# EAGLE design MAin_Backup (EAGLE 7.2.0)
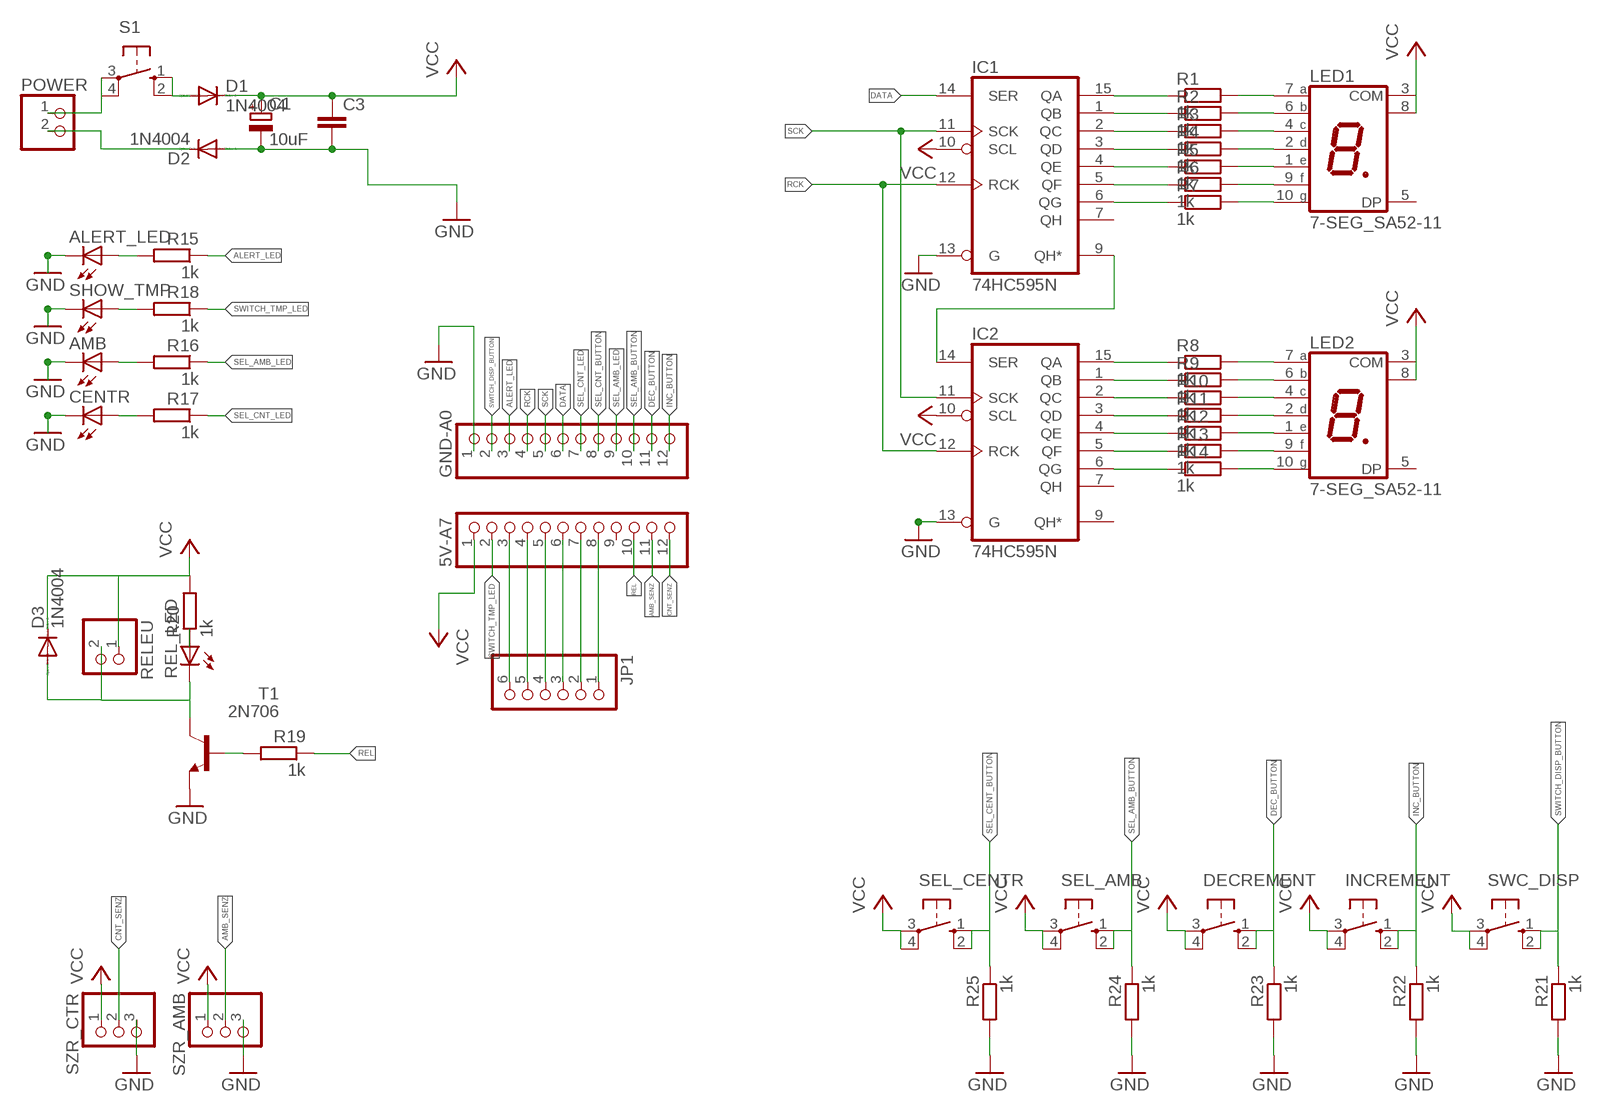
[diagram p0: schematic, sheet 1]

## Parts
5V-A7  PINHD-1X12  [1X12]
ALERT_LED  LED5MM  [LED5MM]
AMB  LED5MM  [LED5MM]
C1  10uF  CPOL-EUE2-5  [E2-5]
C3  C-EU025-024X044  [C025-024X044]
CENTR  LED5MM  [LED5MM]
D1  1N4004  [DO41-10]
D2  1N4004  [DO41-10]
D3  1N4004  [DO41-10]
DECREMENT  40-XX  [B3F-40XX]
GND-A0  PINHD-1X12  [1X12]
IC1  74HC595N  [DIL16]
IC2  74HC595N  [DIL16]
INCREMENT  40-XX  [B3F-40XX]
JP1  PINHD-1X6  [1X06]
LED1  7-SEG_SA52-11  [SA52-11]
LED2  7-SEG_SA52-11  [SA52-11]
POWER  PINHD-1X2  [1X02]
R1  1k  R-EU_0309/12  [0309/12]
R2  1k  R-EU_0309/12  [0309/12]
R3  1k  R-EU_0309/12  [0309/12]
R4  1k  R-EU_0309/12  [0309/12]
R5  1k  R-EU_0309/12  [0309/12]
R6  1k  R-EU_0309/12  [0309/12]
R7  1k  R-EU_0309/12  [0309/12]
R8  1k  R-EU_0309/12  [0309/12]
R9  1k  R-EU_0309/12  [0309/12]
R10  1k  R-EU_0309/12  [0309/12]
R11  1k  R-EU_0309/12  [0309/12]
R12  1k  R-EU_0309/12  [0309/12]
R13  1k  R-EU_0309/12  [0309/12]
R14  1k  R-EU_0309/12  [0309/12]
R15  1k  R-EU_0309/12  [0309/12]
R16  1k  R-EU_0309/12  [0309/12]
R17  1k  R-EU_0309/12  [0309/12]
R18  1k  R-EU_0309/12  [0309/12]
R19  1k  R-EU_0309/12  [0309/12]
R20  1k  R-EU_0309/12  [0309/12]
R21  1k  R-EU_0309/12  [0309/12]
R22  1k  R-EU_0309/12  [0309/12]
R23  1k  R-EU_0309/12  [0309/12]
R24  1k  R-EU_0309/12  [0309/12]
R25  1k  R-EU_0309/12  [0309/12]
REL_LED  LED5MM  [LED5MM]
RELEU  PINHD-1X2  [1X02]
S1  10-XX  [B3F-10XX]
SEL_AMB  40-XX  [B3F-40XX]
SEL_CENTR  40-XX  [B3F-40XX]
SHOW_TMP  LED5MM  [LED5MM]
SWC_DISP  40-XX  [B3F-40XX]
SZR_AMB  PINHD-1X3  [1X03]
SZR_CTR  PINHD-1X3  [1X03]
T1  2N706  [TO18]

## Nets
ALERT_LED: GND-A0.3 R15.1
AMB_SENZ: 5V-A7.11 SZR_AMB.2
CNT_SENZ: 5V-A7.12 SZR_CTR.2
DATA: GND-A0.6 IC1.14(SER)
DEC_BUTTON: DECREMENT.1(S) DECREMENT.2(S1) GND-A0.11 R23.1
GND: ALERT_LED.K(C) AMB.K(C) C1.- C3.2 CENTR.K(C) D2.A GND-A0.1 IC1.13(G) IC2.13(G) R21.2 R22.2 R23.2 R24.2 R25.2 SHOW_TMP.K(C) SZR_AMB.3 SZR_CTR.3 T1.1(E)
INC_BUTTON: GND-A0.12 INCREMENT.1(S) INCREMENT.2(S1) R22.1
N$1: LED1.7(A) R1.2
N$2: LED1.6(B) R2.2
N$3: LED1.4(C) R3.2
N$4: LED1.2(D) R4.2
N$5: LED1.1(E) R5.2
N$6: LED1.9(F) R6.2
N$7: LED1.10(G) R7.2
N$8: LED2.7(A) R8.2
N$9: LED2.6(B) R9.2
N$10: LED2.4(C) R10.2
N$11: LED2.2(D) R11.2
N$12: LED2.1(E) R12.2
N$13: LED2.9(F) R13.2
N$14: LED2.10(G) R14.2
N$15: IC1.15(QA) R1.1
N$16: IC1.1(QB) R2.1
N$17: IC1.2(QC) R3.1
N$18: IC1.3(QD) R4.1
N$19: IC1.4(QE) R5.1
N$20: IC1.5(QF) R6.1
N$21: IC1.6(QG) R7.1
N$22: IC2.15(QA) R8.1
N$23: IC2.1(QB) R9.1
N$24: IC2.2(QC) R10.1
N$25: IC2.3(QD) R11.1
N$26: IC2.4(QE) R12.1
N$27: IC2.5(QF) R13.1
N$28: IC2.6(QG) R14.1
N$29: IC1.9(QH*) IC2.14(SER)
N$30: 5V-A7.8 JP1.1
N$31: 5V-A7.7 JP1.2
N$32: 5V-A7.6 JP1.3
N$33: 5V-A7.5 JP1.4
N$34: 5V-A7.4 JP1.5
N$35: 5V-A7.3 JP1.6
N$36: D1.A S1.1(S) S1.2(S1)
N$37: POWER.1 S1.3(P) S1.4(P1)
N$38: ALERT_LED.A R15.2
N$41: D2.C POWER.2
N$43: R20.1 REL_LED.A
N$44: R19.2 T1.2(B)
N$47: AMB.A R16.2
N$48: CENTR.A R17.2
N$49: R18.2 SHOW_TMP.A
N$54: D3.A REL_LED.K(C) RELEU.2 T1.3(C)
RCK: GND-A0.4 IC1.12(RCK) IC2.12(RCK)
REL: 5V-A7.10 R19.1
SCK: GND-A0.5 IC1.11(SCK) IC2.11(SCK)
SEL_AMB_BUTTON: GND-A0.10 R24.1 SEL_AMB.1(S) SEL_AMB.2(S1)
SEL_AMB_LED: GND-A0.9 R16.1
SEL_CENT_BUTTON: GND-A0.7 R25.1 SEL_CENTR.1(S) SEL_CENTR.2(S1)
SEL_CNT_BUTTON: GND-A0.8
SEL_CNT_LED: R17.1
SWITCH_DISP_BUTTON: GND-A0.2 R21.1 SWC_DISP.1(S) SWC_DISP.2(S1)
SWITCH_TMP_LED: 5V-A7.2 R18.1
VCC: 5V-A7.1 C1.+ C3.1 D1.C D3.C DECREMENT.3(P) DECREMENT.4(P1) IC1.10(SCL) IC2.10(SCL) INCREMENT.3(P) INCREMENT.4(P1) LED1.3(COM) LED1.8(COM) LED2.3(COM) LED2.8(COM) R20.2 RELEU.1 SEL_AMB.3(P) SEL_AMB.4(P1) SEL_CENTR.3(P) SEL_CENTR.4(P1) SWC_DISP.3(P) SWC_DISP.4(P1) SZR_AMB.1 SZR_CTR.1
Unconnected: 5V-A7.9 IC1.7(QH) IC2.7(QH) IC2.9(QH*) LED1.5(DP) LED2.5(DP)

## Power pins joined to a net without a drawn wire
GND: IC1.8(GND) IC2.8(GND)
VCC: IC1.16(VCC) IC2.16(VCC)

## Library data of the parts
5V-A7 GND-A0 = pinhead:PINHD-1X12: PIN HEADER
ALERT_LED AMB CENTR REL_LED SHOW_TMP = led:LED: LED OSRAM: - CHIPLED LG R971, LG N971, LY N971, LG Q971, LY Q971, LO R971, LY R971 LH N974, LH R974 LS Q976, LO Q976, LY Q976 LO Q996 - Hyper CHIPLED LW Q18S LB Q993, LB Q99A, LB R99A - SideLED LS A670, LO A670, LY A670, LG A670, LP A670 LB A673, LV A673, LT A673, LW A673 LH A674 LY A675 LS A676, LA A676, LO A676, LY A676, LW A676 LS A679, LY A679, LG A679 - Hyper Micro SIDELED® LS Y876, LA Y876, LO Y876, LY Y876 LT Y87S - SmartLED LW L88C, LW L88S LB L89C, LB L89S, LG L890 LS L89K, LO L89K, LY L89K LS L896, LA L896, LO L896, LY L896 - TOPLED LS T670, LO T670, LY T670, LG T670, LP T670 LSG T670, LSP T670, LSY T670, LOP T670, LYG T670 LG T671, LOG T671, LSG T671 LB T673, LV T673, LT T673, LW T673 LH T674 LS T676, LA T676, LO T676, LY T676, LB T676, LH T676, LSB T676, LW T676 LB T67C, LV T67C, LT T67C, LS T67K, LO T67K, LY T67K, LW E67C LS E67B, LA E67B, LO E67B, LY E67B, LB E67C, LV E67C, LT E67C LW T67C LS T679, LY T679, LG T679 LS T770, LO T770, LY T770, LG T770, LP T770 LB T773, LV T773, LT T773, LW T773 LH T774 LS E675, LA E675, LY E675, LS T675 LS T776, LA T776, LO T776, LY T776, LB T776 LHGB T686 LT T68C, LB T68C - Hyper Mini TOPLED® LB M676 - Mini TOPLED Santana® LG M470 LS M47K, LO M47K, LY M47K Source: http://www.osram.convergy.de LUXEON: - LUMILED® LXK2-PW12-R00, LXK2-PW12-S00, LXK2-PW14-U00, LXK2-PW14-V00 LXK2-PM12-R00, LXK2-PM12-S00, LXK2-PM14-U00 LXK2-PE12-Q00, LXK2-PE12-R00, LXK2-PE12-S00, LXK2-PE14-T00, LXK2-PE14-U00 LXK2-PB12-K00, LXK2-PB12-L00, LXK2-PB12-M00, LXK2-PB14-N00, LXK2-PB14-P00, LXK2-PB14-Q00 LXK2-PR12-L00, LXK2-PR12-M00, LXK2-PR14-Q00, LXK2-PR14-R00 LXK2-PD12-Q00, LXK2-PD12-R00, LXK2-PD12-S00 LXK2-PH12-R00, LXK2-PH12-S00 LXK2-PL12-P00, LXK2-PL12-Q00, LXK2-PL12-R00 Source: www.luxeon.com KINGBRIGHT: KA-3528ASYC Source: www.kingbright.com
C1 = resistor:CPOL-EU: POLARIZED CAPACITOR, European symbol
C3 = resistor:C-EU: CAPACITOR, European symbol
D1-D3 = diode:1N4004: DIODE general purpose rectifier, 1 A
DECREMENT INCREMENT SEL_AMB SEL_CENTR SWC_DISP = switch-omron:40-XX: OMRON SWITCH; MF: OMRON COMPONENTS USA; MPN: B3F-4000; OC_FARNELL: 176434; OC_NEWARK: 36K3105
IC1 IC2 = 74xx-eu:74*595: 8-bit SHIFT REGISTER, output latch
JP1 = pinhead:PINHD-1X6: PIN HEADER
LED1 LED2 = display-kingbright:7-SEG_: Kingbright 14.2mm (0.56 INCH) SINGLE DIGIT NUMERIC DUISPLAY Source: SA56-11EWA(Ver1189471036.pdf; OC_FARNELL: unknown; OC_NEWARK: unknown
POWER RELEU = pinhead:PINHD-1X2: PIN HEADER
R1-R25 = resistor:R-EU_: RESISTOR, European symbol
S1 = switch-omron:10-XX: OMRON SWITCH; MPN: B3F-1000; OC_FARNELL: 176432; OC_NEWARK: 36M3542
SZR_AMB SZR_CTR = pinhead:PINHD-1X3: PIN HEADER
T1 = transistor:2N706: NPN TRANSISTOR

## Board
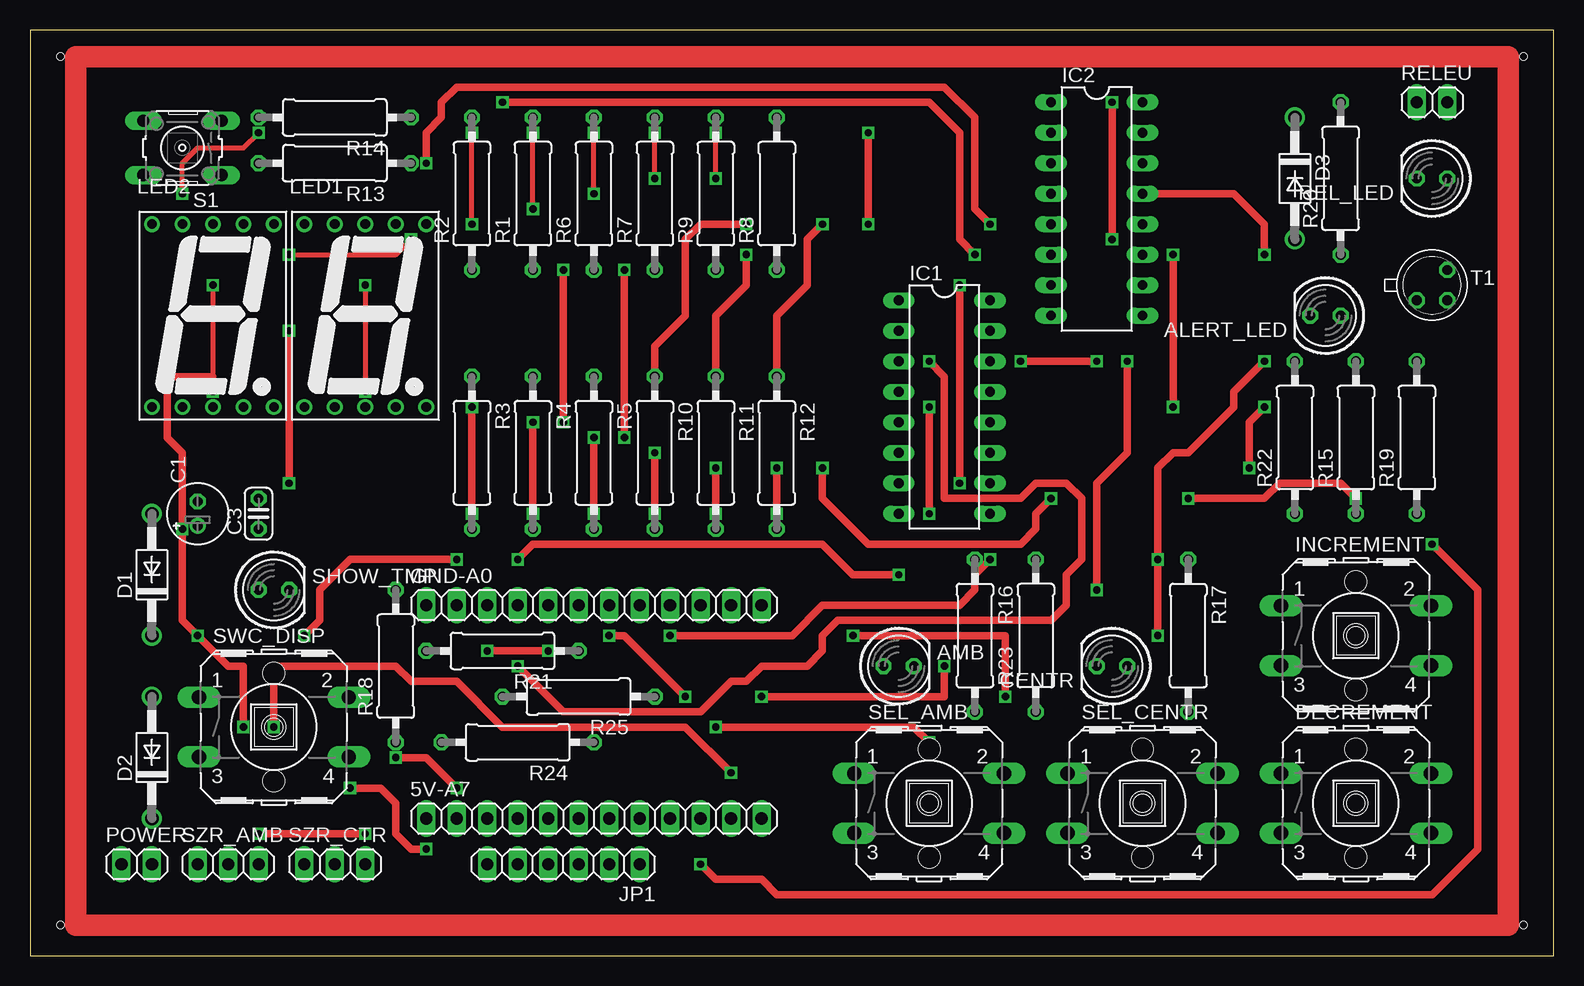
[diagram p1: board, top side]
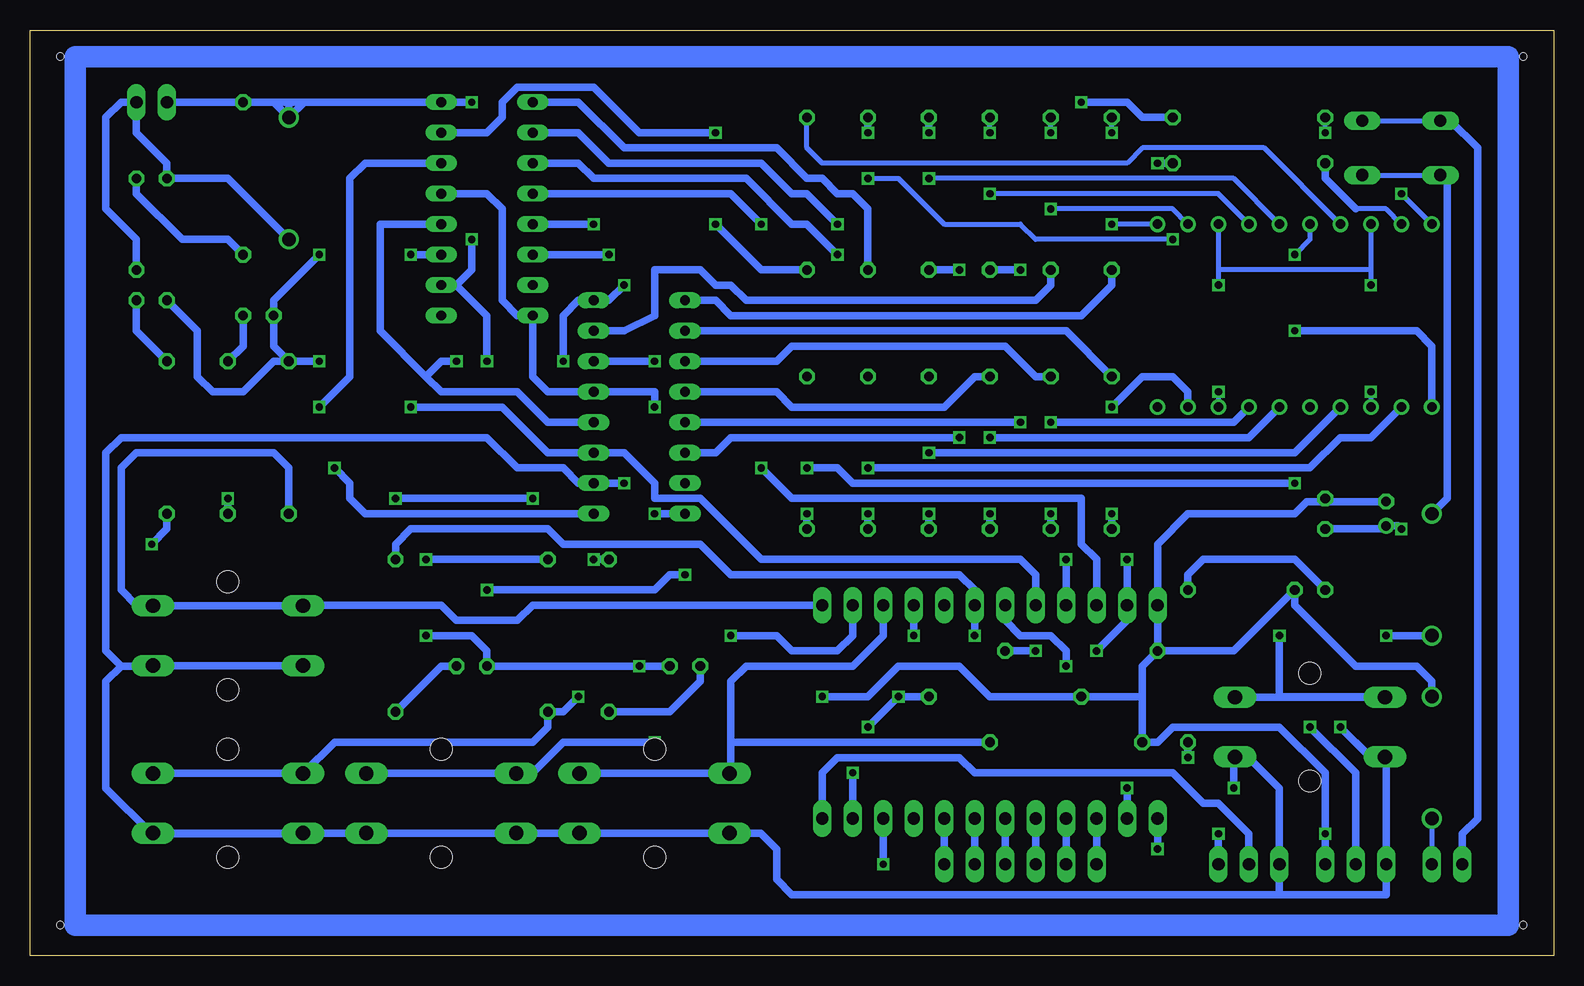
[diagram p2: board, bottom side, seen from below]

Size 126.98 x 77.14 mm. Coordinates in mm from the lower left corner, seen from the top.
Outline: 0,0 126.98,0 126.98,77.14 0,77.14 0,0
Copper layers (1*16): Top 0.035mm / dielectric 1.5mm / Bottom 0.035mm
Design rules "default *": minimum track width 24mil, minimum drill 24mil, track to track 1.6mm, track to pad 1.6mm, pad to pad 8mil, via to via 8mil, smd to smd 8mil, copper to edge 40mil, drill to drill 8mil, minimum pad ring 10mil, minimum via ring 8mil, stop-mask expansion 4mil, vias tented up to drill 0mil, thermal gap 10mil
Holes 0.6 mm at 2.54,74.93 124.46,74.93 124.46,2.54 2.54,2.54

### Footprints (pad centres in the part's own frame; a part is rotated, then mirrored left to right if it is on the bottom)
1X12 = drill 1.016 long: 1 -13.97,0; 2 -11.43,0; 3 -8.89,0; 4 -6.35,0; 5 -3.81,0; 6 -1.27,0; 7 1.27,0; 8 3.81,0; 9 6.35,0; 10 8.89,0; 11 11.43,0; 12 13.97,0
LED5MM = drill 0.813 octagon: A -1.27,0; K 1.27,0
E2-5 = drill 0.813 pad 1.27: + -1.016,0 | drill 0.813 pad 1.27 octagon: - 1.016,0
C025-024X044 = drill 0.813 octagon: 1 -1.27,0; 2 1.27,0
DO41-10 = drill 1.118: A 5.08,0; C -5.08,0
B3F-40XX = drill 1.194 long: 1 -6.248,2.489; 2 6.248,2.489; 3 -6.248,-2.489; 4 6.248,-2.489 | hole 1.803: 0,-4.496; 0,4.496
DIL16 = drill 0.813 long: 1 -8.89,-3.81; 2 -6.35,-3.81; 3 -3.81,-3.81; 4 -1.27,-3.81; 5 1.27,-3.81; 6 3.81,-3.81; 7 6.35,-3.81; 8 8.89,-3.81; 9 8.89,3.81; 10 6.35,3.81; 11 3.81,3.81; 12 1.27,3.81; 13 -1.27,3.81; 14 -3.81,3.81; 15 -6.35,3.81; 16 -8.89,3.81
1X06 = drill 1.016 long: 1 -6.35,0; 2 -3.81,0; 3 -1.27,0; 4 1.27,0; 5 3.81,0; 6 6.35,0
SA52-11 = drill 0.8: 1 -5.08,-7.62; 2 -2.54,-7.62; 3 0,-7.62; 4 2.54,-7.62; 5 5.08,-7.62; 6 5.08,7.62; 7 2.54,7.62; 8 0,7.62; 9 -2.54,7.62; 10 -5.08,7.62
1X02 = drill 1.016 long: 1 -1.27,0; 2 1.27,0
0309/12 = drill 0.813 octagon: 1 -6.35,0; 2 6.35,0
B3F-10XX = drill 1.016 long: 1 -3.251,2.261; 2 3.251,2.261; 3 -3.251,-2.261; 4 3.251,-2.261
1X03 = drill 1.016 long: 1 -2.54,0; 2 0,0; 3 2.54,0
TO18 = drill 0.813 octagon: 1 -1.27,-1.27; 2 1.27,-1.27; 3 1.27,1.27

### Placement (x,y rotation side)
5V-A7  46.99,11.43 0 top
ALERT_LED  107.95,53.34 180 top
AMB  72.39,24.13 0 top
C1  13.97,36.83 90 top
C3  19.05,36.83 90 top
CENTR  90.17,24.13 180 top
D1  10.16,31.75 90 top
D2  10.16,16.51 90 top
D3  105.41,64.77 270 top
DECREMENT  110.49,12.7 0 top
GND-A0  46.99,29.21 0 top
IC1  76.2,45.72 270 top
IC2  88.9,62.23 270 top
INCREMENT  110.49,26.67 0 top
JP1  44.45,7.62 180 top
LED1  27.94,53.34 0 top
LED2  15.24,53.34 0 top
POWER  8.89,7.62 0 top
R1  41.91,63.5 90 top
R2  36.83,63.5 90 top
R3  36.83,41.91 270 top
R4  41.91,41.91 270 top
R5  46.99,41.91 270 top
R6  46.99,63.5 90 top
R7  52.07,63.5 90 top
R8  62.23,63.5 90 top
R9  57.15,63.5 90 top
R10  52.07,41.91 270 top
R11  57.15,41.91 270 top
R12  62.23,41.91 270 top
R13  25.4,66.04 180 top
R14  25.4,69.85 180 top
R15  110.49,43.18 90 top
R16  78.74,26.67 270 top
R17  96.52,26.67 270 top
R18  30.48,24.13 90 top
R19  115.57,43.18 90 top
R20  109.22,64.77 90 top
R21  39.37,25.4 180 top
R22  105.41,43.18 90 top
R23  83.82,26.67 90 top
R24  40.64,17.78 180 top
R25  45.72,21.59 180 top
REL_LED  116.84,64.77 180 top
RELEU  116.84,71.12 0 top
S1  12.7,67.31 180 top
SEL_AMB  74.93,12.7 0 top
SEL_CENTR  92.71,12.7 0 top
SHOW_TMP  20.32,30.48 0 top
SWC_DISP  20.32,19.05 0 top
SZR_AMB  16.51,7.62 0 top
SZR_CTR  25.4,7.62 0 top
T1  116.84,55.88 0 top

### Tracks (layer width: path | path; a pad name or v marks a point on that pad's centre or on a via)
ALERT_LED  (via drill 0.61)
  Top 0.61: v66.04,40.64 66.04,38.1 69.85,34.29 82.55,34.29 83.82,35.56 83.82,36.83 v85.09,38.1 | v96.52,38.1 102.87,38.1 104.14,39.37 109.22,39.37 v110.49,38.1
  Bottom 0.61: GND-A0.3 38.1,33.02 39.37,34.29 39.37,38.1 63.5,38.1 v66.04,40.64 | v85.09,38.1 v96.52,38.1 | v110.49,38.1 R15.1
AMB_SENZ  (via drill 0.61)
  Top 0.61: v20.32,19.05 20.32,24.13 30.48,24.13 31.75,22.86 35.56,22.86 39.37,19.05 54.61,19.05 v58.42,15.24
  Bottom 0.61: SZR_AMB.2 16.51,15.24 v20.32,19.05 | v58.42,15.24 5V-A7.11
CNT_SENZ
  Bottom 0.61: SZR_CTR.2 25.4,10.16 27.94,12.7 29.21,12.7 31.75,15.24 48.26,15.24 49.53,16.51 59.69,16.51 60.96,15.24 5V-A7.12
DATA  (via drill 0.61)
  Top 0.61: v74.93,49.53 76.2,48.26 76.2,38.1 82.55,38.1 83.82,39.37 86.36,39.37 87.63,38.1 87.63,33.02 86.36,31.75 86.36,29.21 85.09,27.94 67.31,27.94 66.04,26.67 66.04,25.4 64.77,24.13 60.96,24.13 59.69,22.86 58.42,22.86 55.88,20.32 44.45,20.32 v40.64,24.13
  Bottom 0.61: IC1.14 v74.93,49.53 | v40.64,24.13 40.64,25.4 41.91,26.67 44.45,26.67 45.72,27.94 GND-A0.6
DEC_BUTTON  (via drill 0.61)
  Top 0.61: v81.28,21.59 81.28,26.67 v68.58,26.67
  Bottom 0.61: DECREMENT.2 DECREMENT.1 104.19,15.19 101.6,17.78 85.09,17.78 83.82,19.05 R23.1 82.55,20.32 v81.28,21.59 | v68.58,26.67 64.77,26.67 63.5,25.4 59.69,25.4 58.42,26.67 GND-A0.11
GND  (via drill 0.61)
  Top 0.61: v74.93,45.72 v74.93,36.83 | v102.87,58.42 102.87,60.96 100.33,63.5 IC2.13 | v93.98,26.67 v93.98,33.02 93.98,40.64 95.25,41.91 96.52,41.91 100.33,45.72 100.33,46.99 v102.87,49.53 | v76.2,24.13 76.2,21.59 v60.96,21.59 | v19.05,10.16 v27.94,10.16
  Bottom 0.61: R22.2 106.68,49.53 109.22,46.99 111.76,46.99 113.03,48.26 113.03,52.07 T1.1 | R22.2 106.68,50.8 ALERT_LED.K 106.68,54.61 v102.87,58.42 | v74.93,45.72 74.93,46.99 IC1.13 83.82,46.99 85.09,48.26 IC2.8 86.36,53.34 87.63,54.61 87.63,62.23 88.9,63.5 IC2.13 | v74.93,36.83 IC1.8 | v93.98,26.67 90.17,26.67 88.9,25.4 CENTR.K v76.2,24.13 AMB.K | R23.2 v93.98,33.02 | SZR_CTR.3 v27.94,10.16 | SZR_AMB.3 v19.05,10.16 19.05,15.24 22.86,19.05 31.75,19.05 33.02,17.78 R24.2 34.29,21.59 | 34.29,21.59 34.29,24.13 R21.2 | 34.29,21.59 R25.2 46.99,21.59 49.53,24.13 54.61,24.13 57.15,21.59 v60.96,21.59 | R21.2 26.67,25.4 SHOW_TMP.K 21.59,29.21 16.51,24.13 11.43,24.13 10.16,22.86 D2.A | v102.87,49.53 R22.2 | C1.- 19.05,37.85 | 19.05,37.85 C3.2 | 19.05,37.85 20.57,37.85 21.59,36.83 30.48,36.83 33.02,34.29 GND-A0.1 R21.2
INC_BUTTON
  Bottom 0.61: INCREMENT.1 INCREMENT.2 116.79,29.21 118.11,29.21 119.38,30.48 119.38,40.64 118.11,41.91 106.68,41.91 105.41,40.64 R22.1 | 102.92,29.21 INCREMENT.1 | GND-A0.12 85.09,29.21 86.36,27.94 91.44,27.94 92.71,29.21 104.19,29.21 INCREMENT.1
N$1  (via drill 0.61)
  Top 0.406: v41.91,62.23 v41.91,68.58
  Bottom 0.406: LED1.7 31.75,62.23 v41.91,62.23 | v41.91,68.58 R1.2
N$2  (via drill 0.61)
  Top 0.406: v36.83,60.96 v36.83,68.58
  Bottom 0.406: LED1.6 v36.83,60.96 | v36.83,68.58 R2.2
N$3  (via drill 0.61)
  Top 0.61: v36.83,45.72 v36.83,36.83
  Bottom 0.61: v36.83,45.72 34.29,48.26 31.75,48.26 30.48,46.99 LED1.4 | v36.83,36.83 R3.2
N$4  (via drill 0.61)
  Top 0.61: v41.91,44.45 v41.91,36.83
  Bottom 0.61: LED1.2 26.67,44.45 v41.91,44.45 | v41.91,36.83 R4.2
N$5  (via drill 0.61)
  Top 0.61: v46.99,43.18 v46.99,36.83
  Bottom 0.61: LED1.1 25.4,43.18 v46.99,43.18 | v46.99,36.83 R5.2
N$6  (via drill 0.61)
  Top 0.406: v46.99,63.5 v46.99,68.58
  Bottom 0.406: LED1.9 27.94,63.5 v46.99,63.5 | v46.99,68.58 R6.2
N$7  (via drill 0.61)
  Top 0.406: v52.07,64.77 v52.07,68.58
  Bottom 0.406: LED1.10 26.67,64.77 v52.07,64.77
  Bottom 0.61: R7.2 v52.07,68.58
N$8
  Bottom 0.406: LED2.7 24.13,67.31 34.29,67.31 35.56,66.04 60.96,66.04 62.23,67.31 R8.2
N$9  (via drill 0.61)
  Top 0.406: v21.59,58.42 30.48,58.42 v31.75,59.69 | v57.15,64.77 v57.15,68.58
  Bottom 0.406: LED2.6 20.32,59.69 v21.59,58.42 | v31.75,59.69 43.18,59.69 44.45,60.96 50.8,60.96 54.61,64.77 v57.15,64.77
  Bottom 0.61: R9.2 v57.15,68.58
N$10  (via drill 0.61)
  Top 0.61: v52.07,41.91 v52.07,36.83
  Bottom 0.61: LED2.4 21.59,41.91 v52.07,41.91 | v52.07,36.83 R10.2
N$11  (via drill 0.61)
  Top 0.61: v57.15,40.64 v57.15,36.83
  Bottom 0.61: LED2.2 15.24,43.18 17.78,43.18 20.32,40.64 v57.15,40.64 | v57.15,36.83 R11.2
N$12  (via drill 0.61)
  Top 0.61: v62.23,36.83 v62.23,40.64 | v21.59,39.37 v21.59,52.07
  Bottom 0.61: R12.2 v62.23,36.83 | v62.23,40.64 59.69,40.64 58.42,39.37 v21.59,39.37 | v21.59,52.07 11.43,52.07 10.16,50.8 LED2.1
N$13
  Bottom 0.406: LED2.9 13.97,62.23 16.51,62.23
  Bottom 0.61: 16.51,62.23 19.05,64.77 R13.2
N$14  (via drill 0.61)
  Top 0.406: v12.7,63.5 12.7,66.04 13.97,67.31 17.78,67.31 v19.05,68.58
  Bottom 0.406: LED2.10 v12.7,63.5 | v19.05,68.58 R14.2
N$15
  Bottom 0.61: R1.1 41.91,55.88 43.18,54.61 67.31,54.61 68.58,55.88 69.85,55.88 71.12,57.15 74.93,57.15 74.93,53.34 77.47,52.07 IC1.15
N$16
  Bottom 0.61: R2.1 36.83,55.88 39.37,53.34 68.58,53.34 69.85,54.61 IC1.1
N$17
  Bottom 0.61: IC1.2 40.64,52.07 R3.1
N$18
  Bottom 0.61: R4.1 43.18,48.26 45.72,50.8 63.5,50.8 64.77,49.53 IC1.3
N$19
  Bottom 0.61: R5.1 48.26,48.26 50.8,45.72 63.5,45.72 64.77,46.99 IC1.4
N$20  (via drill 0.61)
  Top 0.61: v44.45,57.15 v44.45,44.45
  Bottom 0.61: R6.1 v44.45,57.15 | v44.45,44.45 IC1.5
N$21  (via drill 0.61)
  Top 0.61: v49.53,57.15 v49.53,43.18
  Bottom 0.61: R7.1 v49.53,57.15 | v49.53,43.18 68.58,43.18 69.85,41.91 IC1.6
N$22  (via drill 0.61)
  Top 0.61: v69.85,60.96 v69.85,68.58
  Bottom 0.61: R8.1 66.04,57.15 v69.85,60.96 | v69.85,68.58 76.2,68.58 80.01,72.39 86.36,72.39 87.63,71.12 87.63,69.85 88.9,68.58 IC2.15 91.44,68.58
N$23
  Bottom 0.61: IC2.1 81.28,71.12 77.47,67.31 64.77,67.31 62.23,64.77 60.96,64.77 59.69,63.5 58.42,63.5 57.15,62.23 R9.1
N$24  (via drill 0.61)
  Top 0.61: v59.69,60.96 55.88,60.96 54.61,59.69 54.61,53.34 52.07,50.8 R10.1
  Bottom 0.61: IC2.2 81.28,68.58 78.74,66.04 66.04,66.04 63.5,63.5 62.23,63.5 v59.69,60.96
N$25  (via drill 0.61)
  Top 0.61: v59.69,58.42 59.69,55.88 57.15,53.34 R11.1
  Bottom 0.61: IC2.3 81.28,66.04 80.01,64.77 67.31,64.77 63.5,60.96 62.23,60.96 v59.69,58.42
N$26  (via drill 0.61)
  Top 0.61: v66.04,60.96 64.77,59.69 64.77,55.88 62.23,53.34 R12.1
  Bottom 0.61: IC2.4 68.58,63.5 v66.04,60.96
N$27  (via drill 0.61)
  Top 0.61: v33.02,66.04 33.02,68.58 34.29,69.85 34.29,71.12 35.56,72.39 76.2,72.39 78.74,69.85 78.74,62.23 v80.01,60.96
  Bottom 0.61: R13.1 v33.02,66.04 | v80.01,60.96 IC2.5
N$28  (via drill 0.61)
  Top 0.61: v39.37,71.12 74.93,71.12 77.47,68.58 77.47,59.69 v78.74,58.42
  Bottom 0.61: R14.1 34.29,69.85 35.56,71.12 v39.37,71.12 | v78.74,58.42 IC2.6
N$29  (via drill 0.61)
  Top 0.61: v102.87,45.72 101.6,44.45 v101.6,40.64
  Bottom 0.61: IC2.14 99.06,66.04 100.33,64.77 100.33,48.26 v102.87,45.72 | IC1.9 99.06,36.83 100.33,38.1 100.33,39.37 v101.6,40.64
N$30
  Bottom 0.61: JP1.1 5V-A7.8
N$31
  Bottom 0.61: 5V-A7.7 JP1.2
N$32
  Bottom 0.61: 5V-A7.6 JP1.3
N$33
  Bottom 0.61: 5V-A7.5 JP1.4
N$34
  Bottom 0.61: 5V-A7.4 JP1.5
N$35
  Bottom 0.61: 5V-A7.3 JP1.6
N$36
  Bottom 0.406: 8.89,64.49 S1.2 S1.1
  Bottom 0.61: 8.89,64.49 8.89,38.1 D1.A
N$37
  Bottom 0.406: S1.3 S1.4
  Bottom 0.61: S1.4 8.61,69.57 6.35,67.31 6.35,11.43 7.62,10.16 POWER.1
N$38
  Bottom 0.61: ALERT_LED.A 109.22,50.8 R15.2
N$41
  Bottom 0.406: D2.C POWER.2
N$43
  Bottom 0.61: REL_LED.A 118.11,63.5 114.3,59.69 110.49,59.69 R20.1
N$44
  Bottom 0.61: R19.2 118.11,52.07 T1.2
N$47
  Bottom 0.61: AMB.A 71.12,22.86 73.66,20.32 R16.2
N$48
  Bottom 0.61: CENTR.A 92.71,24.13 R17.2
N$49
  Bottom 0.61: SHOW_TMP.A 21.59,33.02 29.21,33.02 30.48,31.75 R18.2
N$54
  Bottom 0.61: T1.3 118.11,59.69 120.65,62.23 120.65,69.85 119.38,71.12 RELEU.2 118.11,68.58 115.57,66.04 REL_LED.K 110.49,64.77 D3.A
N$59
  Bottom 1.778: 3.81,74.93 3.81,2.54 123.19,2.54 123.19,74.93 3.81,74.93
N$60
  Top 1.778: 3.81,74.93 3.81,2.54 123.19,2.54 123.19,74.93 3.81,74.93
RCK  (via drill 0.61)
  Top 0.61: v40.64,33.02 41.91,34.29 66.04,34.29 68.58,31.75 v72.39,31.75 | v88.9,30.48 88.9,39.37 91.44,41.91 v91.44,49.53
  Bottom 0.61: IC2.12 97.79,60.96 97.79,52.07 93.98,48.26 | v40.64,33.02 GND-A0.4 | IC1.12 83.82,44.45 86.36,46.99 92.71,46.99 93.98,48.26 | v72.39,31.75 73.66,31.75 74.93,30.48 v88.9,30.48 | v91.44,49.53 92.71,49.53 93.98,48.26
REL  (via drill 0.61)
  Top 0.61: v116.84,34.29 120.65,30.48 120.65,8.89 116.84,5.08 62.23,5.08 60.96,6.35 57.15,6.35 v55.88,7.62
  Bottom 0.61: R19.1 115.57,35.56 v116.84,34.29 | v55.88,7.62 5V-A7.10
SCK  (via drill 0.61)
  Top 0.61: v95.25,45.72 v95.25,58.42
  Bottom 0.61: v95.25,58.42 IC2.11 | GND-A0.5 43.18,31.75 44.45,33.02 66.04,33.02 71.12,38.1 74.93,38.1 74.93,39.37 77.47,41.91 IC1.11 83.82,41.91 87.63,45.72 v95.25,45.72
SEL_AMB_BUTTON
  Bottom 0.61: SEL_AMB.2 69.9,15.19 69.85,15.24 68.73,15.24 SEL_AMB.1 | GND-A0.10 55.88,26.67 58.42,24.13 67.31,24.13 68.58,22.86 68.58,17.78 | 68.58,17.78 68.58,15.29 SEL_AMB.1 | 68.63,15.24 SEL_AMB.1 | R24.1 68.58,17.78
SEL_AMB_LED  (via drill 0.61)
  Top 0.61: v53.34,26.67 63.5,26.67 66.04,29.21 77.47,29.21 78.74,30.48 78.74,31.75 v80.01,33.02
  Bottom 0.61: v53.34,26.67 GND-A0.9 | v80.01,33.02 R16.1
SEL_CENT_BUTTON  (via drill 0.61)
  Top 0.61: v57.15,19.05 73.66,19.05 v74.93,17.78 | v48.26,26.67 49.53,26.67 v54.61,21.59
  Bottom 0.61: SEL_CENTR.2 SEL_CENTR.1 86.41,15.24 85.09,15.24 82.55,17.78 v74.93,17.78 | R25.1 v54.61,21.59 55.25,20.95 v57.15,19.05 | GND-A0.7 v48.26,26.67
SEL_CNT_LED
  Bottom 0.61: 48.26,30.48 49.53,31.75 68.58,31.75 71.12,34.29 82.55,34.29 83.82,35.56 95.25,35.56 96.52,34.29 R17.1
SWITCH_DISP_BUTTON  (via drill 0.61)
  Top 0.61: v38.1,25.4 v43.18,25.4 | v35.56,33.02 26.67,33.02 24.13,30.48 24.13,27.94 v22.86,26.67
  Bottom 0.406: SWC_DISP.1 SWC_DISP.2
  Bottom 0.61: SWC_DISP.2 14.02,21.54 13.97,21.59 22.86,21.59 v22.86,26.67 | v43.18,25.4 R21.1 | v38.1,25.4 35.56,27.94 GND-A0.2 v35.56,33.02
SWITCH_TMP_LED  (via drill 0.61)
  Top 0.61: v35.56,13.97 33.02,16.51 v30.48,16.51
  Bottom 0.61: v35.56,13.97 5V-A7.2 | v30.48,16.51 R18.1
VCC  (via drill 0.61)
  Top 0.406: v27.94,55.88 v27.94,46.99 | v15.24,55.88 15.24,48.26 v15.24,46.99
  Top 0.61: v77.47,55.88 v77.47,39.37 | v88.9,49.53 v82.55,49.53 | v90.17,59.69 v90.17,71.12 | v17.78,19.05 17.78,24.13 16.51,24.13 v13.97,26.67 12.7,27.94 v12.7,35.56 12.7,41.91 11.43,43.18 11.43,48.26 15.24,48.26 | v33.02,8.89 31.75,8.89 30.48,10.16 30.48,12.7 29.21,13.97 v26.67,13.97
  Bottom 0.406: LED1.8 27.94,57.15 | LED2.8 15.24,57.15 | 15.24,57.15 27.94,57.15 | 27.94,57.15 v27.94,55.88 | v27.94,46.99 LED1.3 | 15.24,57.15 v15.24,55.88 | v15.24,46.99 LED2.3
  Bottom 0.61: RELEU.1 R20.2 106.68,71.12 | DECREMENT.3 SEL_CENTR.4 SEL_CENTR.3 SEL_AMB.4 SEL_AMB.3 66.09,10.21 64.77,8.89 64.77,6.35 63.5,5.08 22.86,5.08 | DECREMENT.3 106.63,10.21 106.68,10.16 | 106.68,10.16 104.29,10.16 DECREMENT.3 | DECREMENT.3 DECREMENT.4 | 106.68,10.16 116.84,10.16 120.65,13.97 120.65,22.86 119.38,24.13 | 118.11,24.13 116.79,24.13 INCREMENT.4 INCREMENT.3 118.06,24.18 118.11,24.13 | D3.C 106.68,71.12 | 106.68,71.12 105.41,71.12 | D3.C 105.41,71.12 | 105.41,71.12 104.14,71.12 | D3.C 104.14,71.12 | 104.14,71.12 IC2.16 v90.17,71.12 | v77.47,55.88 78.74,54.61 IC1.16 81.28,54.61 82.55,53.34 v82.55,49.53 | v77.47,39.37 IC1.10 81.28,39.37 82.55,40.64 86.36,40.64 88.9,43.18 119.38,43.18 120.65,41.91 120.65,25.4 119.38,24.13 | 91.44,55.88 88.9,53.34 v88.9,49.53 | IC2.10 91.44,55.88 | 91.44,55.88 90.17,57.15 v90.17,59.69 | 118.11,24.13 119.38,24.13 | 22.86,5.08 13.97,5.08 SZR_AMB.1 13.97,16.46 SWC_DISP.3 15.29,16.56 v17.78,19.05 15.24,16.51 | 25.4,16.51 25.45,16.56 SWC_DISP.4 | SWC_DISP.4 26.52,16.51 25.4,16.51 | 25.4,16.51 22.86,13.97 SZR_CTR.1 22.86,5.08 | C3.1 13.97,35.56 C1.+ 12.95,35.81 v12.7,35.56 | D1.C v13.97,26.67 | 5V-A7.1 v33.02,8.89 | v26.67,13.97 26.67,16.46 SWC_DISP.4